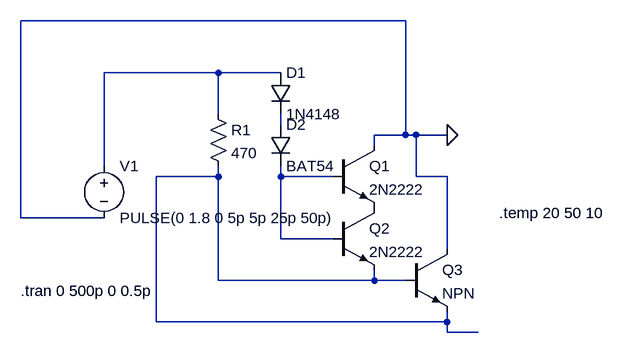
[diagram p0: schematic Draft1.asc]
Draft1.asc, the LTspice schematic file:
Version 4.1
SHEET 1 880 680
WIRE 464 -320 -128 -320
WIRE 176 -240 0 -240
WIRE 272 -240 176 -240
WIRE 176 -176 176 -240
WIRE 272 -160 272 -176
WIRE 464 -144 464 -320
WIRE 464 -144 416 -144
WIRE 480 -144 464 -144
WIRE 528 -144 480 -144
WIRE 416 -128 416 -144
WIRE 0 -96 0 -240
WIRE 176 -80 176 -96
WIRE 176 -80 80 -80
WIRE 272 -80 272 -96
WIRE 352 -80 272 -80
WIRE 480 -80 480 -144
WIRE 528 -80 480 -80
WIRE -128 -16 -128 -320
WIRE 0 -16 -128 -16
WIRE 272 16 272 -80
WIRE 352 16 272 16
WIRE 528 32 528 -80
WIRE 176 80 176 -80
WIRE 416 80 416 64
WIRE 416 80 176 80
WIRE 464 80 416 80
WIRE 80 144 80 -80
WIRE 528 144 528 128
WIRE 528 144 80 144
WIRE 528 160 528 144
WIRE 576 160 528 160
FLAG 528 -144 0
SYMBOL npn 352 -128 R0
SYMATTR InstName Q1
SYMATTR Value 2N2222
SYMBOL npn 352 -32 R0
SYMATTR InstName Q2
SYMATTR Value 2N2222
SYMBOL diode 256 -240 R0
SYMATTR InstName D1
SYMATTR Value 1N4148
SYMBOL diode 256 -160 R0
SYMATTR InstName D2
SYMATTR Value BAT54
SYMBOL voltage 0 -112 R0
WINDOW 123 0 0 Left 0
WINDOW 39 0 0 Left 0
SYMATTR InstName V1
SYMATTR Value PULSE(0 1.8 0 5p 5p 25p 50p)
SYMBOL res 160 -192 R0
SYMATTR InstName R1
SYMATTR Value 470
SYMBOL npn 464 32 R0
SYMATTR InstName Q3
TEXT -128 96 Left 2 !.tran 0 500p 0 0.5p
TEXT 608 -24 Left 2 !.temp 20 50 10

The netlist it stands for:
* Draft1.asc
Q1 0 N004 P001 0 2N2222
Q2 P001 N004 N003 0 2N2222
D1 N001 N002 1N4148
D2 N002 N004 BAT54
V1 N001 0 PULSE(0 1.8 0 5p 5p 25p 50p)
R1 N001 N003 470
Q3 0 N003 N003 0 NPN
.model D D
.lib standard.dio
.model NPN NPN
.model PNP PNP
.lib standard.bjt
.tran 0 500p 0 0.5p
.temp 20 50 10
.backanno
.end